# Altium schematic sheet cc3d.SchDoc
size A3
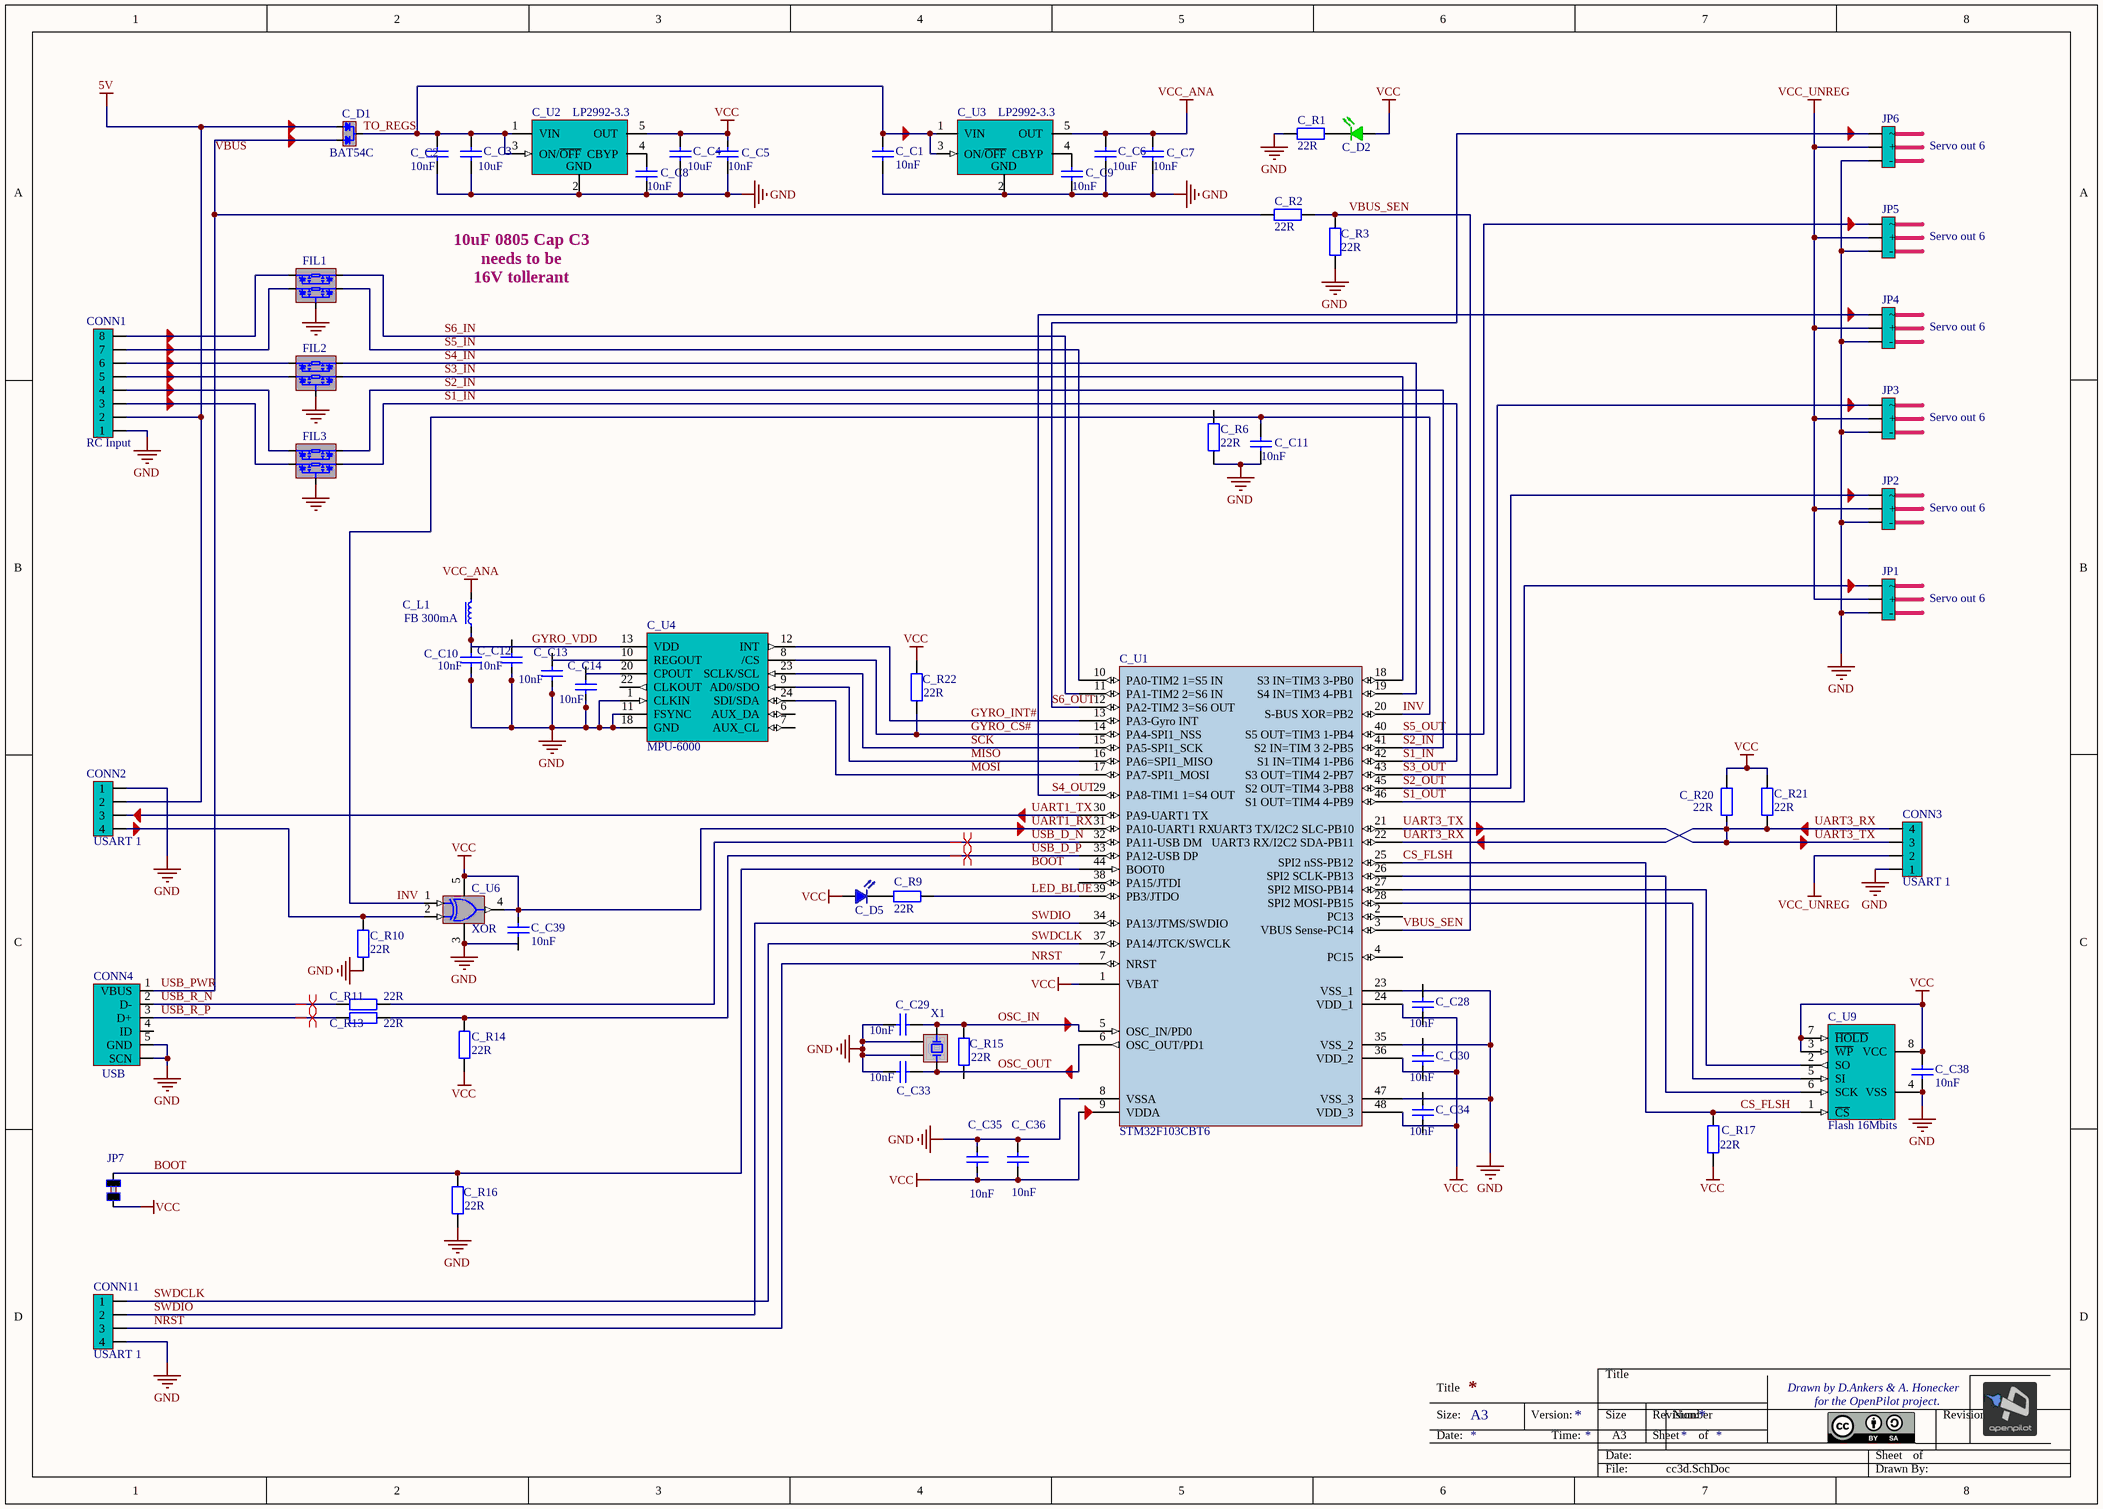
[diagram p0: cc3d.SchDoc]

## Parts
C_C1  value 10nF  [CAP603N]  (hidden comment: Cap603)
C_C2  value 10nF  [CAP603L]  (hidden comment: Cap603)
C_C3  value 10uF  [CAP805L]  (hidden comment: Cap805)
C_C4  value 10uF  [CAP805L]  (hidden comment: Cap805)
C_C5  value 10nF  [CAP603N]  (hidden comment: Cap603)
C_C6  value 10uF  [CAP805L]  (hidden comment: Cap805)
C_C7  value 10nF  [CAP603N]  (hidden comment: Cap603)
C_C8  value 10nF  [CAP603N]  (hidden comment: Cap603)
C_C9  value 10nF  [CAP603N]  (hidden comment: Cap603)
C_C10  value 10nF  [CAP603L]  (hidden comment: Cap603)
C_C11  value 10nF  [CAP603N]  (hidden comment: Cap603)
C_C12  value 10nF  [CAP603L]  (hidden comment: Cap603)
C_C13  value 10nF  [CAP603L]  (hidden comment: Cap603)
C_C14  value 10nF  [CAP603L]  (hidden comment: Cap603)
C_C28  value 10nF  [CAP603N]  (hidden comment: Cap603)
C_C29  value 10nF  [CAP603N]  (hidden comment: Cap603)
C_C30  value 10nF  [CAP603N]  (hidden comment: Cap603)
C_C33  value 10nF  [CAP603N]  (hidden comment: Cap603)
C_C34  value 10nF  [CAP603N]  (hidden comment: Cap603)
C_C35  value 10nF  [CAP603L]  (hidden comment: Cap603)
C_C36  value 10nF  [CAP603N]  (hidden comment: Cap603)
C_C38  value 10nF  [CAP603N]  (hidden comment: Cap603)
C_C39  value 10nF  [CAP603N]  (hidden comment: Cap603)
C_D1  BAT54C  [SOT23-3N]
C_D2  Green  [LED603N]  (value not drawn)
C_D5  Blue  [LED603N]  (value not drawn)
C_L1  FB 300mA  [IND603N]
C_R1  value 22R  [RES603N]  (hidden comment: Res603)
C_R2  value 22R  [RES603N]  (hidden comment: Res603)
C_R3  value 22R  [RES603N]  (hidden comment: Res603)
C_R6  value 22R  [RES603N]  (hidden comment: Res603)
C_R9  value 22R  [RES603N]  (hidden comment: Res603)
C_R10  value 22R  [RES603N]  (hidden comment: Res603)
C_R11  value 22R  [RES603N]  (hidden comment: Res603)
C_R13  value 22R  [RES603N]  (hidden comment: Res603)
C_R14  value 22R  [RES603N]  (hidden comment: Res603)
C_R15  value 22R  [RES603N]  (hidden comment: Res603)
C_R16  value 22R  [RES603N]  (hidden comment: Res603)
C_R17  value 22R  [RES603N]  (hidden comment: Res603)
C_R20  value 22R  [RES603N]  (hidden comment: Res603)
C_R21  value 22R  [RES603N]  (hidden comment: Res603)
C_R22  value 22R  [RES603N]  (hidden comment: Res603)
C_U1  STM32F103CBT6  [STM32 48 Lead]
C_U2  LP2992-3.3  [SOT23-5L]
C_U3  LP2992-3.3  [SOT23-5L]
C_U4  MPU-6000  [IMU-3000]
C_U6  XOR  [DCK-5]
C_U9  Flash 16Mbits  [SOIC8_N]
CONN1  RC Input  [JST SH 8 Pin Side Entry]
CONN2  USART 1  [JST SH 4 Pin Side Entry]
CONN3  USART 1  [JST SH 4 Pin Side Entry]
CONN4  USB  [USB SMD]
CONN11  USART 1  [JST SH 4 Pin Side Entry]
FIL1  IP4256CZ5-W,115  [SOT-665]  (value not drawn)
FIL2  IP4256CZ5-W,115  [SOT-665]  (value not drawn)
FIL3  IP4256CZ5-W,115  [SOT-665]  (value not drawn)
JP1  Servo out 6  [SIP3 - 0.1]
JP2  Servo out 6  [SIP3 - 0.1]
JP3  Servo out 6  [SIP3 - 0.1]
JP4  Servo out 6  [SIP3 - 0.1]
JP5  Servo out 6  [SIP3 - 0.1]
JP6  Servo out 6  [SIP3 - 0.1]
JP7  2 PAD Touch JMP  [TOUCH JMP 2PAD]  (value not drawn)
X1  8MHz  [XTAL ACT530SMX-4 Series]  (value not drawn)

## Nets
5V: C_D1.2(A2) CONN1.2 CONN2.2
GND: C_C1.2 C_C2.2 C_C3.2 C_C4.2 C_C5.2 C_C6.2 C_C7.2 C_C8.2 C_C9.2 C_C10.2 C_C11.2 C_C12.2 C_C13.2 C_C14.1 C_C29.1 C_C33.1 C_C35.2 C_C36.1 C_C38.2 C_R1.1 C_R3.1 C_R6.1 C_R10.1 C_R16.1 C_U1.8(VSSA) C_U1.23(VSS_1) C_U1.35(VSS_2) C_U1.47(VSS_3) C_U2.2(GND) C_U3.2(GND) C_U4.1(CLKIN) C_U4.11(FSYNC) C_U4.18(GND) C_U6.3(GND) C_U9.4(VSS) CONN1.1 CONN2.1 CONN3.1 CONN4.0(SCN) CONN4.5(GND) CONN11.4 FIL1.2(PAD) FIL2.2(PAD) FIL3.2(PAD) JP1.3(-) JP2.3(-) JP3.3(-) JP4.3(-) JP5.3(-) JP6.3(-) X1.2 X1.4
UART1_RX: C_C4.1 C_C5.1 C_C35.1 C_C36.2 C_C38.1 C_C39.1 C_D2.2(A) C_D5.2(A) C_R14.1 C_R17.1 C_R20.2 C_R21.2 C_R22.2 C_U1.1(VBAT) C_U1.9(VDDA) C_U1.24(VDD_1) C_U1.31(PA10-UART1_RX) C_U1.36(VDD_2) C_U1.48(VDD_3) C_U2.5(OUT) C_U6.4(Y) C_U6.5(VCC) C_U9.3(~{WP}) C_U9.7(~{HOLD}) C_U9.8(VCC) JP7.2  [also labelled VCC]
VCC_ANA: C_C6.1 C_C7.1 C_L1.2 C_U3.5(OUT)
VCC_UNREG: CONN3.2 JP1.2(+) JP2.2(+) JP3.2(+) JP4.2(+) JP5.2(+) JP6.2(+)
BOOT: C_R16.2 C_U1.44(BOOT0) JP7.1
CS_FLSH: C_R17.2 C_U1.25(SPI2_nSS-PB12) C_U9.1(~{CS})
GYRO_CS#: C_R22.1 C_U1.14(PA4-SPI1_NSS) C_U4.8(/CS)
GYRO_INT#: C_U1.13(PA3-Gyro_INT) C_U4.12(INT)
GYRO_VDD: C_C10.1 C_L1.1 C_U4.13(VDD)
INV: C_C11.1 C_U1.20(S-BUS_XOR=PB2) C_U6.1(A)
LED_BLUE: C_R9.2 C_U1.39(PB3/JTDO)
MISO: C_U1.16(PA6=SPI1_MISO) C_U4.9(AD0/SDO)
MOSI: C_U1.17(PA7-SPI1_MOSI) C_U4.24(SDI/SDA)
NRST: C_U1.7(NRST) CONN11.3
OSC_IN: C_C29.2 C_R15.2 C_U1.5(OSC_IN/PD0) X1.3
OSC_OUT: C_C33.2 C_U1.6(OSC_OUT/PD1) X1.1
S1_IN: C_U1.42(S1_IN=TIM4_1-PB6) FIL3.5
S1_OUT: C_U1.46(S1_OUT=TIM4_4-PB9) JP1.1
S2_IN: C_U1.41(S2_IN=TIM_3_2-PB5) FIL3.4
S2_OUT: C_U1.45(S2_OUT=TIM4_3-PB8) JP2.1
S3_IN: C_U1.18(S3_IN=TIM3_3-PB0) FIL2.5
S3_OUT: C_U1.43(S3_OUT=TIM4_2-PB7) JP3.1
S4_IN: C_U1.19(S4_IN=TIM3_4-PB1) FIL2.4
S4_OUT: C_U1.29(PA8-TIM1_1=S4_OUT) JP4.1
S5_IN: C_U1.10(PA0-TIM2_1=S5_IN) FIL1.5
S5_OUT: C_U1.40(S5_OUT=TIM3_1-PB4) JP5.1
S6_IN: C_U1.11(PA1-TIM2_2=S6_IN) FIL1.4
S6_OUT: C_U1.12(PA2-TIM2_3=S6_OUT) JP6.1
SCK: C_U1.15(PA5-SPI1_SCK) C_U4.23(SCLK/SCL)
SWDCLK: C_U1.37(PA14/JTCK/SWCLK) CONN11.1
SWDIO: C_U1.34(PA13/JTMS/SWDIO) CONN11.2
TO_REGS: C_C1.1 C_C2.1 C_C3.1 C_D1.3(COM) C_U2.1(VIN) C_U2.3(ON/~{OFF}) C_U3.1(VIN) C_U3.3(ON/~{OFF})
UART1_TX: C_U1.30(PA9-UART1_TX) CONN2.3
UART3_RX: C_R20.1 C_R21.1 C_U1.21(UART3_TX/I2C2_SLC-PB10) C_U1.22(UART3_RX/I2C2_SDA-PB11) CONN3.3 CONN3.4  [also labelled UART3_TX]
USB_D_N: C_R11.1 C_U1.32(PA11-USB_DM)
USB_D_P: C_R13.1 C_R14.2 C_U1.33(PA12-USB_DP)
USB_PWR: C_D1.1(A1) C_R2.1 CONN4.1(VBUS)  [also labelled VBUS]
USB_R_N: C_R11.2 CONN4.2(D-)
USB_R_P: C_R13.2 CONN4.3(D+)
VBUS_SEN: C_R2.2 C_R3.2 C_U1.3(VBUS_Sense-PC14)
NetC_C8_1: C_C8.1 C_U2.4(CBYP)
NetC_C9_1: C_C9.1 C_U3.4(CBYP)
NetC_D2_1: C_D2.1(K) C_R1.2
NetC_D5_1: C_D5.1(K) C_R9.1
NetC_R10_2: C_R10.2 C_U6.2(B) CONN2.4
NetC_U1_26: C_U1.26(SPI2_SCLK-PB13) C_U9.6(SCK)
NetC_U1_27: C_U1.27(SPI2_MISO-PB14) C_U9.2(SO)
NetC_U1_28: C_U1.28(SPI2_MOSI-PB15) C_U9.5(SI)
NetCONN1_3: CONN1.3 FIL3.1
NetCONN1_4: CONN1.4 FIL3.3
NetCONN1_5: CONN1.5 FIL2.1
NetCONN1_6: CONN1.6 FIL2.3
NetCONN1_7: CONN1.7 FIL1.1
NetCONN1_8: CONN1.8 FIL1.3

Not connected (* = marked no-connect by the designer): C_C12 1; C_C13 1; C_C14 2; C_C28 1 2; C_C30 1 2; C_C34 1 2; C_C39 2; C_R6 2; C_R15 1; C_U1 2(PC13) 4(PC15) 38(PA15/JTDI); C_U4 2(NC) 3(NC) 4(NC) 5(NC) 6(AUX_DA) 7(AUX_CL) 10(REGOUT) 14(NC) 15(NC) 16(NC) 17(NC) 19(RESV) 20(CPOUT) 21(RESV) 22(CLKOUT); CONN4 4(ID)

## Layout directives
differential pair: USB_D_N, USB_D_P, USB_R_N, USB_R_P

## Notes on the sheet
- 10uF 0805 Cap C3
  needs to be
  16V tollerant
- Title
- Drawn by D.Ankers & A. Honecker
- Size:
- Date:
- A3
- Version:
- Time:
- Revision:
- Sheet
- of
- for the OpenPilot project.

## Library data of the parts
C_C1 C_C2 C_C5 C_C7-C_C14 C_C28-C_C30 C_C33-C_C36 C_C38 C_C39 = Cap603: Capacitor SMD; Published: 1-Nov-2010; LatestRevisionDate: 1-Nov-2010; LatestRevisionNote: Released OpenPilot Lib; PackageReference: 0603 (1608 Metric); Publisher: The OpenPilot Project; Supplier 1: Digi-Key; Supplier Part Number 1: 399-1091-1-ND
C_C3 C_C4 C_C6 = Cap805: Capacitor SMD; Published: 1-Nov-2010; LatestRevisionDate: 1-Nov-2010; LatestRevisionNote: Released OpenPilot Lib; PackageReference: 0805 (2012 Metric); Publisher: The OpenPilot Project; Supplier 1: Digi-Key; Supplier Part Number 1: 490-3886-1-ND
C_D1 = BAT54C: Dual Diode Command Cathode; Supplier 1: Digi-Key; Supplier Part Number 1: 497-3786-1-ND
C_D2 = LED 603 Gr: Green 603 LED; Value: 2.1v 20mA; Supplier 1: Digi-Key; Supplier Part Number 1: 754-1116-1-ND
C_D5 = LED 603 Bl: Blue 603 LED; Supplier 1: Digi-Key; Supplier Part Number 1: 350-2037-1-ND
C_L1 = FerriteBead_300mA: Ferrite Bead 300mA; Manufacturer: Generic Components; Class: Passive; Supplier 1: Digi-Key; Supplier Part Number 1: 732-1586-1-ND
C_R1-C_R3 C_R6 C_R9-C_R11 C_R13-C_R17 C_R20-C_R22 = Res603: Resistor SMD; Published: 1-Nov-2010; LatestRevisionDate: 1-Nov-2010; LatestRevisionNote: Released OpenPilot Lib; PackageReference: 0402 (1005 Metric); Publisher: The OpenPilot Project; Supplier 1: Digi-Key; Supplier Part Number 1: P22GCT-ND
C_U1 = STM32F103CBT6: STM32 ARM-based 32-bit MCU with 128 Kbytes Flash, 48-pin LQFP, Industrial Temperature; Published: 30-May-2008; DatasheetVersion: rev6, Mar-2008; PackageVersion: Mar-2008; PackageReference: LQFP48; Publisher: Altium Limited; PackageDescription: 48-Pin Low-Profile Quad Flat Pack, 7 x 7 mm Body, 0.5 mm Pitch (LQFP48); ComponentLink1Description: Manufacturer Link; ComponentLink1URL: www.st.com/stm32; ComponentLink2Description: Datasheet; ComponentLink2URL: http://www.st.com/stonline/products/literature/ds/13587.pdf; Supplier 1: Digi-Key; Supplier Part Number 1: 497-6288-ND
C_U2 C_U3 = LP2985-3.3: 3.3V 250mA LDO Regulator; Manufacturer: National Semiconductor; Manufacturer Part Number: LP2992AIM5-3.3/NOPB; Regulator Topology: Positive Fixed; Voltage - Input: Up to 16V; Voltage - Dropout (Typical): 0.45V @ 250mA; Number of Regulators: 1; Supplier 1: Digi-Key; Supplier Part Number 1: LP2992AIM5-3.3CT-ND; RoHS: RoHS Compliant; Category: Integrated Circuits (ICs); Stock 1: 15821; Pricing 1: 1=1.86, 25=1.4712, 100=1.3239, 250=1.15224, 500=1.02966 (AUD); Voltage - Output: 3.3V; Current - Output: 250mA; Current - Limit (Min): -; Operating Temperature: -40°C ~ 125°C; Mounting Type: Surface Mount; Package / Case: SC-74A, SOT-753; Supplier Device Package: SOT-23-5; Packaging: Cut Tape (CT); ComponentLink1URL: http://www.national.com/ds/LP/LP2992.pdf; ComponentLink1Description: http://www.national.com/ds/LP/LP2992.pdf
C_U4 = MPU-3/6000: Invensense MPU-3/6000,  3-axis Gyros & Accel on 6000; ComponentLink2Description: Datasheet; LatestRevisionDate: 1-Nov-2010; LatestRevisionNote: Released OpenPilot Lib; Published: 1-Nov-2010; Publisher: The OpenPilot Project; Manufacturer: Invensense; Supplier 1: Invensense; Supplier Part Number 1: MPU-6000
C_U6 = XOR SN74LVC1G86DCKR: XOR Gate SN74LVC1G86DCKR; Supplier 1: Digi-Key; Supplier Part Number 1: 296-9854-1-ND
C_U9 = Flash 16Mb 75MHZ 8SOIC: 16Mbit SPI Flash Memory; ComponentLink2Description: Datasheet; LatestRevisionDate: 1-Nov-2010; LatestRevisionNote: Released OpenPilot Lib; Published: 1-Nov-2010; Publisher: The OpenPilot Project; Supplier 1: Digi-Key; Supplier Part Number 1: M25P16-VMN6P-ND
CONN1 = JST-SH 8-pin Side Entry Socket: Manufacturer: Generic Components; Class: Connector; Supplier 1: Digi-Key; Supplier Part Number 1: 455-1808-1-ND
CONN2 CONN3 CONN11 = JST-SH 4-pin Side Entry Socket: Manufacturer: Generic Components; Class: Connector; Supplier 1: Digi-Key; Supplier Part Number 1: 455-1804-1-ND
CONN4 = USB_SMT_B: USB Type-B SMT Socket; Class: Connector; Supplier 1: Digi-Key; Supplier Part Number 1: 670-1190-1-ND
FIL1-FIL3 = RF Filter 100R 30pF: IP4256CZ5-W,115 2 channel, 100R, 30pF, RF ESD Filter; Manufacturer: Generic Components; Class: Passive; Supplier 1: Digi-Key; Supplier Part Number 1: 568-5871-1-ND; ComponentLink2Description: Datasheet; LatestRevisionDate: 1-Nov-2010; LatestRevisionNote: Released OpenPilot Lib; Published: 1-Nov-2010; Publisher: The OpenPilot Project
JP1-JP6 = Hdr 3 Pin 0.1: Header, 3-Pin, 0.1"; Manufacturer: Generic Components; Class: Connector; Supplier 1: Digi-Key; Supplier Part Number 1: MTLW-103-23-S-S-260-ND
JP7 = 2 PAD Touch JMP: 2 Pad Touch Jumper; LatestRevisionDate: 1-Nov-2010; LatestRevisionNote: Released OpenPilot Lib; Published: 1-Nov-2010; Publisher: The OpenPilot Project
X1 = XTAL ACT530SMX-4: Surface Mount Quartz Crystal, Digikey 535-9720-1-ND; Class: Oscillator; SubClass: Crystal Oscillator; Supplier 1: Digi-Key; Supplier Part Number 1: 535-9720-1-ND